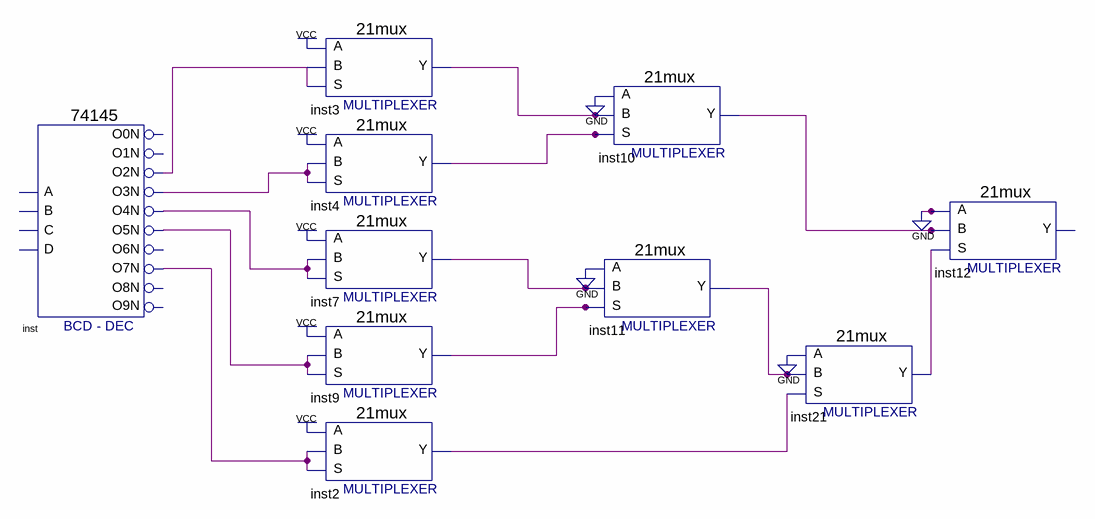
[diagram p0: schematic sheet]
// Quartus schematic lab3_g8_p5_1.bdf as structural Verilog: 10 symbols, 0 pins
module lab3_g8_p5_1 (
);

  wire inst2_y, inst3_y, inst4_y, inst7_y, inst9_y, inst10_y, inst11_y, inst21_y, inst_o2n, inst_o3n,
       inst_o4n, inst_o5n, inst_o7n;

  \74145  inst (
    .O4N(inst_o4n), .O3N(inst_o3n), .O2N(inst_o2n), .O7N(inst_o7n), .O5N(inst_o5n));  // open: C, B, A, D, O9N, O0N, O1N, O6N, O8N
  \21mux  inst3 (.S(inst_o2n), .B(inst_o2n), .A(1'b1), .Y(inst3_y));
  \21mux  inst4 (.S(inst_o3n), .B(inst_o3n), .A(1'b1), .Y(inst4_y));
  \21mux  inst7 (.S(inst_o4n), .B(inst_o4n), .A(1'b1), .Y(inst7_y));
  \21mux  inst9 (.S(inst_o5n), .B(inst_o5n), .A(1'b1), .Y(inst9_y));
  \21mux  inst2 (.S(inst_o7n), .B(inst_o7n), .A(1'b1), .Y(inst2_y));
  \21mux  inst10 (.S(inst4_y), .B(inst3_y), .A(1'b0), .Y(inst10_y));
  \21mux  inst11 (.S(inst9_y), .B(inst7_y), .A(1'b0), .Y(inst11_y));
  \21mux  inst21 (.S(inst2_y), .B(inst11_y), .A(1'b0), .Y(inst21_y));
  \21mux  inst12 (.S(inst21_y), .B(inst10_y), .A(1'b0));  // open: Y
endmodule
